# Altium schematic sheet Sematik.SchDoc
size A4; SheetNumber: 2; SheetTotal: 2
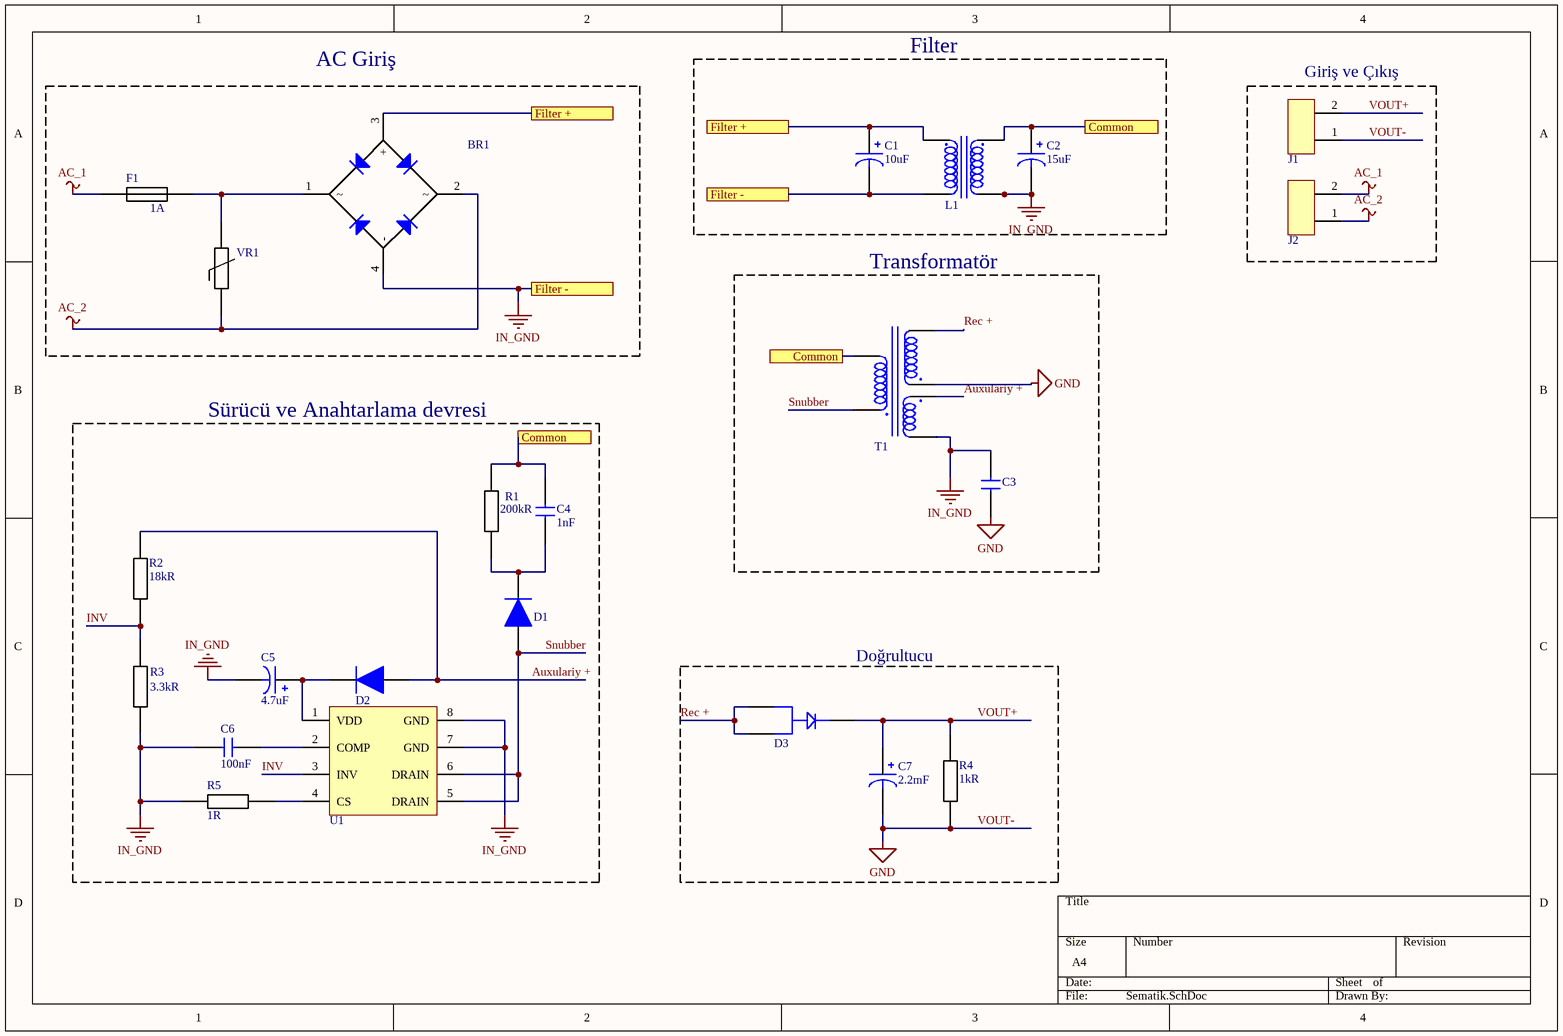
[diagram p0: Sematik.SchDoc]

## Parts
BR1  DB105STR  [DB105STR]  (value not drawn)
C1  value 10uF  [CAP_ALU_10uF]  (hidden comment: UCY2G100MPD1TD)
C2  value 15uF  [CAP_ALU_15uF]  (hidden comment: UCY2G150MPD)
C3  DE2E3SA102MN3AT02F  [CAP_CER_1000pF_250V_RADİAL]  (value not drawn)
C4  value 1nF  [CAP_1206]  (hidden comment: C1206C102KDRACTU)
C5  value 4.7uF  [CAP_ALU_4.7uF]  (hidden comment: 860010672008)
C6  value 100nF  [CAP_0805]  (hidden comment: CL21B104KBCNNNC)
C7  value 2.2mF  [CAP_ALU_2200uF]  (hidden comment: ECA-1AM222)
D1  1N4007G-T  [1N4007G-T Diode]  (value not drawn)
D2  1N4007G-T  [1N4007G-T Diode]  (value not drawn)
D3  SS10P4-M3/86A SCHOTTKY DİODE  [SS10P4-M3/86A]  (value not drawn)
F1  Amper: 1A  [05200101Z Fuse Block]  (hidden comment: 05200101Z)
J1  JACK  [TBP01R1-508]  (value not drawn)
J2  JACK  [TBP01R1-508]  (value not drawn)
L1  LFU09V-102(0.35MM)  [Line Filter Choke Common Mode]  (value not drawn)
R1  value 200kR  [RES-1206]  (hidden comment: RC1206JR-07200KL)
R2  value 18kR  [RES_0805]  (hidden comment: RMCF0805FT18K0)
R3  value 3.3kR  [RES_0805]  (hidden comment: RC0805FR-7W3K3L)
R4  value 1kR  [RES-1206]  (hidden comment: RC1206JR-071KL)
R5  value 1R  [RES-1206]  (hidden comment: RC1206JR-071RL)
T1  750341599  [SMPS TRAFO]  (value not drawn)
U1  UCSR3652SG  [sop-8]  (value not drawn)
VR1  820513011  [820513011 Varistor]  (value not drawn)

## Blocks framed on the sheet
AC Giriş: BR1 F1 VR1
Filter: C1 C2 L1
Giriş ve Çıkış: J1 J2
Transformatör: C3 T1
Sürücü ve Anahtarlama devresi: C4-C6 D1 D2 R1-R3 R5 U1
Doğrultucu: C7 D3 R4

## Ports
Common (see Sematik[2B]), Common (see Sematik[2B], Sematik[3A]), Filter + (see Sematik[2A]), Filter - (see Sematik[2A]), Filter - (see Sematik[2B])

## Nets
AC_1: F1.2 J2.2
AC_2: BR1.2 J2.1 VR1.2
IN_GND: BR1.4(-) C1.2 C2.2 C3.2 C5.2 C6.2 L1.2 L1.3 R3.1 R5.2 T1.4 U1.7(GND) U1.8(GND) ; port Filter -
VOUT-: C3.1 C7.2 J1.1 R4.1 T1.7  [also labelled GND]
Auxulariy +: D2.2 R2.2 T1.5
Common: C2.1 C4.2 L1.4 R1.2 T1.1 ; port Common
Filter +: BR1.3(+) C1.1 L1.1 ; port Filter +
INV: R2.1 R3.2 U1.3(INV)
Rec +: D3.1(ANOT_1) D3.2(ANOT_2) T1.8
Snubber: D1.2 T1.2 U1.5(DRAIN) U1.6(DRAIN)
VOUT+: C7.1 D3.K(KATOT) J1.2 R4.2
NetBR1_1: BR1.1 F1.1 VR1.1
NetC4_1: C4.1 D1.1 R1.1
NetC5_1: C5.1 D2.1 U1.1(VDD)
NetC6_1: C6.1 U1.2(COMP)
NetR5_1: R5.1 U1.4(CS)

## Library data of the parts
BR1 = DB105STR: Bridge Rect 1PHASE 600V 1A Db-s; Manufacturer: Sangdest Microelectronics; Manufacturer Part Number: DB105S; Designed by: Kerem; Supplier: Digikey; Supplier Part Number: 1655-DB105SCT-ND; RoHS: No; Category: Uncategorized; Stock: 8973; Pricing: 1=0,44, 10=0,267, 100=0,1688, 500=0,12602 (USD); ComponentLink1Description: DATASHEET; ComponentLink1URL: https://www.smc-diodes.com/propdf/DB101S%20THRU%20DB107S%20N1459%20REV.B.pdf; Voltage - Peak Reverse (Max): 600V; Current: 1A
C1 = CAP_ALU_10uF: Aluminum Electrolytic Capacitor, Polarized, Aluminum (wet), 400V, 20% +Tol, 20% -Tol, 10uF; Manufacturer: Nichicon; Manufacturer Series: CY; Dielectric Material: Aluminium; Ripple Current: 150mA; Supplier: Mouser; Supplier Part Number: 647-UCY2G100MPD1TD; Manufacturer Part Number: UCY2G100MPD1TD; RoHS: Yes; Category: Aluminum Electrolytic Capacitors; Stock: 11094; Pricing: 1=1,07, 10=0,539, 50=0,539, 100=0,486, 1000=0,351, 10000=0,295 (USD); Pins: 2; Min Operating Temperature: -40°C; Max Operating Temperature: 105°C; Polarity: Polarized; Capacitor Type: Aluminium; Tolerance  (fill in as +-): 20%; Package Style: RadialMeter; Packaging: Tape and Reel; Tolerance (fill in as +-): 20%; Rated DC Voltage (URdc): 400V; Series: CY; Diameter: 10mm; Length: 16mm; Terminal Pitch: 5mm; Reach SVHC Compliant: No; RoHS Compliant: Yes; ComponentLink1URL: https://datasheet.ciiva.com:443/pdfs/VipMasterIC/IC/NICH/NICH-S-A0009255900/NICH-S-A0009255900-1.pdf?src-supplier=IHS+Markit; ComponentLink1Description: https://datasheet.ciiva.com:443/pdfs/VipMasterIC/IC/NICH/NICH-S-A0009255900/NICH-S-A0009255900-1.pdf?src-supplier=IHS+Markit; ComponentLink2URL: https://datasheet.ciiva.com/29547/e-cy-29547366.pdf?src-supplier=Digikey; ComponentLink2Description: https://datasheet.ciiva.com/29547/e-cy-29547366.pdf?src-supplier=Digikey; ComponentLink3URL: https://datasheet.ciiva.com/29547/e-cy-29547367.pdf?src-supplier=Digikey; ComponentLink3Description: https://datasheet.ciiva.com/29547/e-cy-29547367.pdf?src-supplier=Digikey
C2 = CAP_ALU_15uF: Aluminum Electrolytic Capacitor, Polarized, Aluminum (wet), 400V, 20% +Tol, 20% -Tol, 15uF; Manufacturer: Nichicon; Dielectric Material: Aluminium; Ripple Current: 180mA; Supplier: Mouser; Supplier Part Number: 647-UCY2G150MPD; Manufacturer Part Number: UCY2G150MPD; RoHS: Yes; Category: Aluminum Electrolytic Capacitors; Stock: 1314; Pricing: 1=1,25, 10=0,861, 50=0,861, 100=0,632, 1000=0,491, 10000=0,425 (USD); Pins: 2; Terminal Finish: Copper; Min Operating Temperature: -40°C; Max Operating Temperature: 105°C; Polarity: Polarized; Capacitor Type: Aluminium; Tolerance  (fill in as +-): 20%; Package Style: RadialMeter; Packaging: Bulk; Tolerance (fill in as +-): 20%; Rated DC Voltage (URdc): 400V; JESD-609 Code: e3; Diameter: 10mm; Length: 20mm; Terminal Pitch: 5mm; Reach SVHC Compliant: No; RoHS Compliant: Yes; ComponentLink1URL: https://datasheet.ciiva.com:443/pdfs/VipMasterIC/IC/NICH/NICH-S-A0003527728/NICH-S-A0003527728-1.pdf?src-supplier=IHS+Markit; ComponentLink1Description: https://datasheet.ciiva.com:443/pdfs/VipMasterIC/IC/NICH/NICH-S-A0003527728/NICH-S-A0003527728-1.pdf?src-supplier=IHS+Markit; ComponentLink2URL: https://datasheet.ciiva.com/114/e-cy-114566.pdf?src-supplier=Digikey; ComponentLink2Description: https://datasheet.ciiva.com/114/e-cy-114566.pdf?src-supplier=Digikey; ComponentLink3URL: https://datasheet.ciiva.com/11686/e-cy-11686537.pdf?src-supplier=Avnet; ComponentLink3Description: https://datasheet.ciiva.com/11686/e-cy-11686537.pdf?src-supplier=Avnet; ComponentLink4URL: https://datasheet.ciiva.com/5329/e-cy-8386-5329868.pdf?src-supplier=Mouser; ComponentLink4Description: https://datasheet.ciiva.com/5329/e-cy-8386-5329868.pdf?src-supplier=Mouser
C3 = CAP_CER_1000pF_250V_RADİAL: Ceramic Capacitor, Ceramic, 20% +Tol, 20% -Tol, E, -55/+20% TC, 0.001uF, Through Hole Mount; Manufacturer: Murata; Supplier: Mouser; Supplier Part Number: 81-DE2E3SA102MN3AT2F; Manufacturer Part Number: DE2E3SA102MN3AT02F; RoHS: Yes; Category: Ceramic Capacitors; Stock: 12396; Pricing: 1=0,49, 10=0,297, 50=0,297, 100=0,145, 1000=0,11, 10000=0,109 (USD); Pins: 2; Dielectric Material: Ceramic; Capacitor Type: Ceramic; Reach SVHC Compliant: Yes; RoHS Compliant: Yes; ComponentLink1URL: https://psearch.en.murata.com:443/capacitor/product/DE2E3SA102MN3AT02F.pdf?src-supplier=IHS+Markit; ComponentLink1Description: https://psearch.en.murata.com:443/capacitor/product/DE2E3SA102MN3AT02F.pdf?src-supplier=IHS+Markit; ComponentLink2URL: https://search.murata.co.jp/Ceramy/image/img/A01X/G101/ENG/DE2_SA_T0_F_E.pdf?src-supplier=Digikey; ComponentLink2Description: https://search.murata.co.jp/Ceramy/image/img/A01X/G101/ENG/DE2_SA_T0_F_E.pdf?src-supplier=Digikey; ComponentLink3URL: https://datasheet.octopart.com/DE2E3SA102MN3AT02F-Murata-datasheet-166166228.pdf?src-supplier=TME; ComponentLink3Description: https://datasheet.octopart.com/DE2E3SA102MN3AT02F-Murata-datasheet-166166228.pdf?src-supplier=TME
C4 = CAP_CER_1nF_1206: Ceramic Capacitor, Multilayer, Ceramic, 1000V, 10% +Tol, 10% -Tol, X7R, 15% TC, 0.001uF, Surface Mount, 1206; Manufacturer: KEMET; Multilayer: Yes; Rated DC Voltage (URdc): 1kV; Supplier: Mouser; Supplier Part Number: 80-C1206C102KDR; Manufacturer Part Number: C1206C102KDRACTU; RoHS: Yes; Category: Ceramic Capacitors; Stock: 27008; Pricing: 1=0,23, 10=0,114, 50=0,114, 100=0,068, 1000=0,049, 10000=0,036 (USD); Mounting Technology: Surface Mount; Pins: 2; Dielectric Material: Ceramic; Package Shape: Rectangular; Case/Package: 1206; Terminal Finish: Nickel; Min Operating Temperature: -55°C; Max Operating Temperature: 125°C; JESD-609 Code: e3; Capacitor Type: Ceramic; Tolerance  (fill in as +-): 10%; Package Style: SMTMeter; Packaging: Tape and Reel; Tolerance (fill in as +-): 10%; Temperature Characteristics Code: X7R; Termination: Wraparound; Length: 3.2mm; Width: 1.6mm; Height: 1.2mm; Reach SVHC Compliant: Yes; RoHS Compliant: Yes; ComponentLink1URL: https://datasheet.ciiva.com:443/pdfs/VipMasterIC/IC/KEME/KEME-S-A0007630859/KEME-S-A0007630859-1.pdf?src-supplier=IHS+Markit; ComponentLink1Description: https://datasheet.ciiva.com:443/pdfs/VipMasterIC/IC/KEME/KEME-S-A0007630859/KEME-S-A0007630859-1.pdf?src-supplier=IHS+Markit; ComponentLink2URL: https://datasheet.ciiva.com/19476/1567931-19476446.pdf?src-supplier=Jameco; ComponentLink2Description: https://datasheet.ciiva.com/19476/1567931-19476446.pdf?src-supplier=Jameco; ComponentLink3URL: https://datasheet.ciiva.com/22700/1812017-22700535.pdf?src-supplier=Element14; ComponentLink3Description: https://datasheet.ciiva.com/22700/1812017-22700535.pdf?src-supplier=Element14; ComponentLink4URL: https://datasheet.ciiva.com/28610/1918693-28610894.pdf?src-supplier=Element14; ComponentLink4Description: https://datasheet.ciiva.com/28610/1918693-28610894.pdf?src-supplier=Element14
C5 = CAP_ALU_4.7uF: Aluminum Electrolytic Capacitor, Aluminum (wet); Manufacturer: Wurth Electronics; Dielectric Material: Aluminium; Supplier: Mouser; Supplier Part Number: 710-860010672008; Manufacturer Part Number: 860010672008; RoHS: Yes; Category: Aluminum Electrolytic Capacitors; Stock: 5183; Pricing: 1=0,11, 10=0,11, 50=0,096, 100=0,084, 1000=0,056, 10000=0,055 (USD); Pins: 2; Capacitor Type: Aluminium; Reach SVHC Compliant: Yes; RoHS Compliant: Yes; ComponentLink1URL: https://datasheet.ciiva.com:443/pdfs/VipMasterIC/IC/MIDC/MIDC-S-A0000765238/MIDC-S-A0000765796-1.pdf?src-supplier=IHS+Markit; ComponentLink1Description: https://datasheet.ciiva.com:443/pdfs/VipMasterIC/IC/MIDC/MIDC-S-A0000765238/MIDC-S-A0000765796-1.pdf?src-supplier=IHS+Markit; ComponentLink2URL: http://www.farnell.com/datasheets/1879575.pdf?src-supplier=Farnell; ComponentLink2Description: http://www.farnell.com/datasheets/1879575.pdf?src-supplier=Farnell; ComponentLink3URL: http://www.produktinfo.conrad.com/datenblaetter/1200000-1299999/001280181-da-01-en-WCAP_ATG8_ALU_ELEC_CAPS_860010672008.pdf?src-supplier=Conrad; ComponentLink3Description: http://www.produktinfo.conrad.com/datenblaetter/1200000-1299999/001280181-da-01-en-WCAP_ATG8_ALU_ELEC_CAPS_860010672008.pdf?src-supplier=Conrad; ComponentLink4URL: http://katalog.we-online.de/pbs/datasheet/860010672008.pdf?src-supplier=Digikey; ComponentLink4Description: http://katalog.we-online.de/pbs/datasheet/860010672008.pdf?src-supplier=Digikey; ComponentLink5URL: http://www.farnell.com/datasheets/1879575.pdf?src-supplier=Element14; ComponentLink5Description: http://www.farnell.com/datasheets/1879575.pdf?src-supplier=Element14
C6 = CAP_CER_0.1uF_0805: Ceramic Capacitor,50V, %10, 0.1uF, Surface Mount, 0805; Manufacturer: Samsung; Multilayer: Yes; Tolerance  (fill in as +-): 10%; Temperature Characteristics Code: X7R; Designed by: Kerem; Supplier: Digikey; Supplier Part Number: 1276-1003-1-ND; Manufacturer Part Number: CL21B104KBCNNNC; RoHS: Yes; Category: Ceramic Capacitors; Stock: 925106; Pricing: 1=0,1, 10=0,029, 100=0,0175, 1000=0,01156 (USD); Mounting Technology: Surface Mount; Pins: 2; Dielectric Material: Ceramic; Package Shape: Rectangular; Case/Package: 0805; Terminal Finish: Nickel; Min Operating Temperature: -55°C; Max Operating Temperature: 125°C; JESD-609 Code: e3; Capacitor Type: Ceramic; Package Style: SMTMeter; Packaging: Tape and Reel; Tolerance (fill in as +-): 10%; Rated DC Voltage (URdc): 50V; Termination: Wraparound; Length: 2mm; Width: 1.25mm; Height: 0.95mm; Reach SVHC Compliant: Yes; RoHS Compliant: Yes; ComponentLink1URL: https://datasheet.ciiva.com:443/pdfs/VipMasterIC/IC/SEMS/SEMS-S-A0008521003/SEMS-S-A0008521039-1.pdf?src-supplier=IHS+Markit; ComponentLink1Description: https://datasheet.ciiva.com:443/pdfs/VipMasterIC/IC/SEMS/SEMS-S-A0008521003/SEMS-S-A0008521039-1.pdf?src-supplier=IHS+Markit; ComponentLink2URL: https://datasheet.ciiva.com/25710/cl21b104kbcnnnc-25710182.pdf?src-supplier=Digikey; ComponentLink2Description: https://datasheet.ciiva.com/25710/cl21b104kbcnnnc-25710182.pdf?src-supplier=Digikey; ComponentLink3URL: https://datasheet.ciiva.com/29199/454152-da-01-en-vs-kondensator-0805-29199814.pdf?src-supplier=Conrad; ComponentLink3Description: https://datasheet.ciiva.com/29199/454152-da-01-en-vs-kondensator-0805-29199814.pdf?src-supplier=Conrad
C7 = CAP_ALU_2200uF: Aluminum Electrolytic Capacitor, Polarized, Aluminum (wet), 10V, 20% +Tol, 20% -Tol, 2200uF, Through Hole Mount; Manufacturer: Panasonic; Manufacturer Series: M; Dielectric Material: Aluminium; Leakage Current: 220uA; Ripple Current: 920mA; Tan Delta: 0.26; Supplier: Mouser; Supplier Part Number: 667-ECA-1AM222; Manufacturer Part Number: ECA-1AM222; RoHS: Yes; Category: Aluminum Electrolytic Capacitors; Stock: 2404; Pricing: 1=0,63, 10=0,297, 50=0,297, 100=0,23, 1000=0,186, 10000=0,167 (USD); Mounting Technology: Through Hole; Pins: 2; Package Shape: Cylindrical; Terminal Finish: Tin; Min Operating Temperature: -40°C; Max Operating Temperature: 85°C; JESD-609 Code: e3; Polarity: Polarized; Capacitor Type: Aluminium; Tolerance  (fill in as +-): 20%; Package Style: RadialMeter; Packaging: Bulk; Tolerance (fill in as +-): 20%; Rated DC Voltage (URdc): 10V; Series: ECA-M; Termination: Wire; Diameter: 10mm; Length: 20mm; Terminal Pitch: 5mm; Reach SVHC Compliant: Yes; RoHS Compliant: Yes; ComponentLink1URL: https://datasheet.ciiva.com:443/pdfs/VipMasterIC/IC/PANA/PANA-S-A0009459698/PANA-S-A0009459698-1.pdf?src-supplier=IHS+Markit; ComponentLink1Description: https://datasheet.ciiva.com:443/pdfs/VipMasterIC/IC/PANA/PANA-S-A0009459698/PANA-S-A0009459698-1.pdf?src-supplier=IHS+Markit; ComponentLink2URL: https://datasheet.ciiva.com/11780/0900766b80f2e8a9-11780233.pdf?src-supplier=Rs; ComponentLink2Description: https://datasheet.ciiva.com/11780/0900766b80f2e8a9-11780233.pdf?src-supplier=Rs; ComponentLink3URL: https://datasheet.ciiva.com/43458/654936-43458312.pdf?src-supplier=Farnell; ComponentLink3Description: https://datasheet.ciiva.com/43458/654936-43458312.pdf?src-supplier=Farnell; ComponentLink4URL: https://datasheet.ciiva.com/10331/aba0000ce12-10331145.pdf?src-supplier=Avnet; ComponentLink4Description: https://datasheet.ciiva.com/10331/aba0000ce12-10331145.pdf?src-supplier=Avnet; ComponentLink5URL: https://datasheet.ciiva.com/48520/radial-m-eng-tds-48520751.pdf?src-supplier=Distrelec; ComponentLink5Description: https://datasheet.ciiva.com/48520/radial-m-eng-tds-48520751.pdf?src-supplier=Distrelec; ComponentLink6URL: https://datasheet.ciiva.com/30083/49aba0000ce12-30083103.pdf?src-supplier=Onlinecomponents.com; ComponentLink6Description: https://datasheet.ciiva.com/30083/49aba0000ce12-30083103.pdf?src-supplier=Onlinecomponents.com; ComponentLink7URL: https://datasheet.ciiva.com/46387/654936-46387400.pdf?src-supplier=Element14; ComponentLink7Description: https://datasheet.ciiva.com/46387/654936-46387400.pdf?src-supplier=Element14; ComponentLink8URL: https://datasheet.ciiva.com/24027/aba0000ce12-465472-24027112.pdf?src-supplier=Mouser; ComponentLink8Description: https://datasheet.ciiva.com/24027/aba0000ce12-465472-24027112.pdf?src-supplier=Mouser; ComponentLink9URL: https://datasheet.ciiva.com/16395/aba0000ce12-16395615.pdf?src-supplier=Future+Electronics; ComponentLink9Description: https://datasheet.ciiva.com/16395/aba0000ce12-16395615.pdf?src-supplier=Future+Electronics
D1 D2 = 1N4007G-T Diode: Rectifier Diode, 1 Phase, 1 Element, 1A, 1000V V(RRM), Silicon, DO-41; Manufacturer: Diodes; Package Body Material: Plastic; Number of Elements: 1; Rep Pk Reverse Voltage-Max: 1kV; Surface Mount: No; Case Connection: Isolated; Forward Voltage: 1V; Non-rep Pk Forward Current-Max: 30A; Reverse Recovery Time-Max: 2us; Time @ Peak Reflow Temperature-Max (s): 40s; Qualification Status: Not Qualified; Supplier: Mouser; Supplier Part Number: 621-1N4007G-T; Manufacturer Part Number: 1N4007G-T; RoHS: Yes; Category: Rectifier Diodes; Stock: 124927; Pricing: 1=0,16, 10=0,097, 50=0,097, 100=0,08, 1000=0,051, 10000=0,05 (USD); Pins: 2; Diode Element Material: SILICON; Package Shape: Round; Terminal Finish: Tin; Min Operating Temperature: -65°C; Max Operating Temperature: 175°C; JESD-609 Code: e3; Diode Type: RECTIFIER; JESD-30 Code: O-PALF-W2; Max Output current: 1A; Package Style: LONG FORMMeter; Terminal Form: Wire; Terminal Position: AXIAL; Peak Reflow Temperature (Cel): 260°C; RoHS Compliant: Yes; Reach SVHC Compliant: No; JEDEC-95 Code: DO-41; ComponentLink1URL: https://datasheet.ciiva.com:443/pdfs/VipMasterIC/IC/DIOD/DIODS14380/DIODS14380-1.pdf?src-supplier=IHS+Markit; ComponentLink1Description: https://datasheet.ciiva.com:443/pdfs/VipMasterIC/IC/DIOD/DIODS14380/DIODS14380-1.pdf?src-supplier=IHS+Markit; ComponentLink2URL: https://datasheet.ciiva.com/36525/1537942-36525995.pdf?src-supplier=Jameco; ComponentLink2Description: https://datasheet.ciiva.com/36525/1537942-36525995.pdf?src-supplier=Jameco; ComponentLink3URL: https://datasheet.ciiva.com/912/ds29002-912230.pdf?src-supplier=Digikey; ComponentLink3Description: https://datasheet.ciiva.com/912/ds29002-912230.pdf?src-supplier=Digikey; ComponentLink4URL: https://datasheet.ciiva.com/15219/getdatasheetpartid-213960-15219547.pdf?src-supplier=Verical; ComponentLink4Description: https://datasheet.ciiva.com/15219/getdatasheetpartid-213960-15219547.pdf?src-supplier=Verical; ComponentLink5URL: https://datasheet.ciiva.com/16395/ds29002-16395514.pdf?src-supplier=Future+Electronics; ComponentLink5Description: https://datasheet.ciiva.com/16395/ds29002-16395514.pdf?src-supplier=Future+Electronics
D3 = SS10P4-M3/86A: Rectifier Diode, Schottky, 1 Phase, 1 Element, 10A, 40V V(RRM), Silicon, TO-277A; Manufacturer: Vishay Semiconductors; Supplier: Mouser; Supplier Part Number: 625-SS10P4-M3; Manufacturer Part Number: SS10P4-M3/86A; RoHS: No; Category: Rectifier Diodes; Stock: 7172; Pricing: 1=0,93, 10=0,645, 50=0,645, 100=0,521, 1000=0,284, 10000=0,275 (USD); ComponentLink1URL: https://datasheet.ciiva.com:443/pdfs/VipMasterIC/IC/VISH/VISH-S-A0007701170/VISH-S-A0007701170-1.pdf?src-supplier=IHS+Markit; ComponentLink1Description: https://datasheet.ciiva.com:443/pdfs/VipMasterIC/IC/VISH/VISH-S-A0007701170/VISH-S-A0007701170-1.pdf?src-supplier=IHS+Markit; ComponentLink2URL: https://datasheet.ciiva.com/22685/1719836-22685698.pdf?src-supplier=Element14; ComponentLink2Description: https://datasheet.ciiva.com/22685/1719836-22685698.pdf?src-supplier=Element14; ComponentLink3URL: https://datasheet.ciiva.com/4245/ss10p4-4245882.pdf?src-supplier=Arrow+Electronics; ComponentLink3Description: https://datasheet.ciiva.com/4245/ss10p4-4245882.pdf?src-supplier=Arrow+Electronics; ComponentLink4URL: https://datasheet.ciiva.com/911/ss10p4-911286.pdf?src-supplier=Digikey; ComponentLink4Description: https://datasheet.ciiva.com/911/ss10p4-911286.pdf?src-supplier=Digikey; ComponentLink5URL: https://datasheet.ciiva.com/911/ss10p4-911287.pdf?src-supplier=Digikey; ComponentLink5Description: https://datasheet.ciiva.com/911/ss10p4-911287.pdf?src-supplier=Digikey; ComponentLink6URL: https://datasheet.ciiva.com/911/ss10p4-911288.pdf?src-supplier=Digikey; ComponentLink6Description: https://datasheet.ciiva.com/911/ss10p4-911288.pdf?src-supplier=Digikey; ComponentLink7URL: https://datasheet.ciiva.com/16489/ss10p4-16489287.pdf?src-supplier=Future+Electronics; ComponentLink7Description: https://datasheet.ciiva.com/16489/ss10p4-16489287.pdf?src-supplier=Future+Electronics
F1 = 05200101Z Fuse Block: Fuses/Accessories; Manufacturer: Littelfuse; Supplier: Mouser; Supplier Part Number: 576-05200101Z; Manufacturer Part Number: 05200101Z; RoHS: Yes; Category: Fuse Holders; Stock: 10761; Pricing: 1=1,6, 10=1,12, 50=0,908, 100=0,863, 1000=0,718, 10000=0,679 (USD); ComponentLink1URL: https://datasheet.ciiva.com:443/pdfs/VipMasterIC/IC/LFSI/LFSI-S-A0002252627/LFSI-S-A0002252627-1.pdf?src-supplier=IHS+Markit; ComponentLink1Description: https://datasheet.ciiva.com:443/pdfs/VipMasterIC/IC/LFSI/LFSI-S-A0002252627/LFSI-S-A0002252627-1.pdf?src-supplier=IHS+Markit; ComponentLink2URL: https://datasheet.ciiva.com/19458/1712608-19458493.pdf?src-supplier=Jameco; ComponentLink2Description: https://datasheet.ciiva.com/19458/1712608-19458493.pdf?src-supplier=Jameco; ComponentLink3URL: https://datasheet.ciiva.com/295/520-metricomniblock-295549.pdf?src-supplier=Digikey; ComponentLink3Description: https://datasheet.ciiva.com/295/520-metricomniblock-295549.pdf?src-supplier=Digikey; ComponentLink4URL: https://datasheet.ciiva.com/16300/0105-129-clips-16300344.pdf?src-supplier=Future+Electronics; ComponentLink4Description: https://datasheet.ciiva.com/16300/0105-129-clips-16300344.pdf?src-supplier=Future+Electronics; ComponentLink5URL: https://datasheet.ciiva.com/15187/getdatasheetpartid-115097-15187901.pdf?src-supplier=Verical; ComponentLink5Description: https://datasheet.ciiva.com/15187/getdatasheetpartid-115097-15187901.pdf?src-supplier=Verical; ComponentLink6URL: https://datasheet.ciiva.com/4480/520-metricomniblock-4480158.pdf?src-supplier=Mouser; ComponentLink6Description: https://datasheet.ciiva.com/4480/520-metricomniblock-4480158.pdf?src-supplier=Mouser
J1 J2 = TBP01R1-508-02BE: Strip Terminal Block 2 Pins; Manufacturer: CUI Devices; Designed by: Kerem; Supplier: Digikey; Supplier Part Number: 102-6406-ND; Manufacturer Part Number: TBP01R1-508-02BE; RoHS: Yes; Category: Terminal Blocks; Stock: 90039; Pricing: 1=0,47, 10=0,218, 25=0,1684, 50=0,1412, 100=0,121, 400=0,09438, 800=0,08583, 1200=0,08184, 5200=0,0775 (USD); ComponentLink1URL: https://www.cuidevices.com/product/resource/digikeypdf/tbp01r1-508.pdf?src-supplier=Digikey; ComponentLink1Description: https://www.cuidevices.com/product/resource/digikeypdf/tbp01r1-508.pdf?src-supplier=Digikey; ComponentLink2URL: https://datasheet.octopart.com/TBP01R1-508-02BE-CUI-Devices-datasheet-147843976.pdf?src-supplier=Future+Electronics; ComponentLink2Description: https://datasheet.octopart.com/TBP01R1-508-02BE-CUI-Devices-datasheet-147843976.pdf?src-supplier=Future+Electronics; ComponentLink3URL: https://datasheet.octopart.com/TBP01R1-508-02BE-CUI-Devices-datasheet-154730754.pdf?src-supplier=Electro+Sonic; ComponentLink3Description: https://datasheet.octopart.com/TBP01R1-508-02BE-CUI-Devices-datasheet-154730754.pdf?src-supplier=Electro+Sonic
L1 = Line Filter Choke Common Mode
R1 = RES_200K OHM_1206: Fixed Resistor, Metal Glaze/thick Film, 0.25W, 200000ohm, 200V, 5% +/-Tol, 100ppm/Cel, Surface Mount, 1206; Manufacturer: Yageo; Additional Feature: LASER TRIMMABLE; Power: 250mW; Rated Temperature: 70°C; Temperature Coefficient (ppm/Cel): 100; Package Height: 0.55mm; Package Length: 3.1mm; Package Width: 1.6mm; Supplier: Avnet; Supplier Part Number: RC1206JR-07200KL; Manufacturer Part Number: RC1206JR-07200KL; RoHS: Yes; Category: Chip SMD Resistors; Stock: 5000; Pricing: 5000=0,00353, 10000=0,00345, 20000=0,00338, 30000=0,00331, 40000=0,00326 (USD); Mounting Technology: Surface Mount; Pins: 2; Package Shape: Rectangular; Case/Package: 1206; Terminal Finish: Nickel; Min Operating Temperature: -55°C; Max Operating Temperature: 155°C; Tolerance: 5%; JESD-609 Code: e3; Termination: Wraparound; Resistor Type: FIXED RESISTOR; Construction: Chip; Packaging: Tape and Reel; Technology: METAL GLAZE/THICK FILM; Working Voltage: 200V; Reach SVHC Compliant: Yes; RoHS Compliant: Yes; ComponentLink1URL: https://datasheet.ciiva.com:443/pdfs/VipMasterIC/IC/YAGO/YAGO-S-A0008145938/YAGO-S-A0008145938-1.pdf?src-supplier=IHS+Markit; ComponentLink1Description: https://datasheet.ciiva.com:443/pdfs/VipMasterIC/IC/YAGO/YAGO-S-A0008145938/YAGO-S-A0008145938-1.pdf?src-supplier=IHS+Markit; ComponentLink2URL: https://datasheet.ciiva.com/2520/pyu-r-int-thick-7-2520646.pdf?src-supplier=Digikey; ComponentLink2Description: https://datasheet.ciiva.com/2520/pyu-r-int-thick-7-2520646.pdf?src-supplier=Digikey; ComponentLink3URL: https://datasheet.ciiva.com/16746/pyu-rc1206-51-rohs-l-4-16746043.pdf?src-supplier=Future+Electronics; ComponentLink3Description: https://datasheet.ciiva.com/16746/pyu-rc1206-51-rohs-l-4-16746043.pdf?src-supplier=Future+Electronics; ComponentLink4URL: https://datasheet.ciiva.com/2520/pyu-r-int-thick-7-2520645.pdf?src-supplier=Digikey; ComponentLink4Description: https://datasheet.ciiva.com/2520/pyu-r-int-thick-7-2520645.pdf?src-supplier=Digikey
R2 = RES_18K OHM_0805: Fixed Resistor, Metal Glaze/thick Film, 0.125W, 18000ohm, 150V, 1% +/-Tol, 100ppm/Cel, Surface Mount, 0805; Manufacturer: Stackpole Electronics; Power: 125mW; Rated Temperature: 70°C; Temperature Coefficient (ppm/Cel): 100; Package Height: 0.5mm; Package Length: 2mm; Package Width: 1.25mm; Reference Standard: AEC-Q200; Supplier: Avnet; Supplier Part Number: RMCF0805FT18K0; Manufacturer Part Number: RMCF0805FT18K0; RoHS: Yes; Category: Chip SMD Resistors; Stock: 15000; Pricing: 5000=0,00245, 10000=0,00241, 20000=0,00238, 30000=0,00234, 40000=0,0023 (USD); Mounting Technology: Surface Mount; Pins: 2; Package Shape: Rectangular; Case/Package: 0805; Terminal Finish: Nickel; Min Operating Temperature: -55°C; Max Operating Temperature: 155°C; Tolerance: 1%; JESD-609 Code: e3; Resistor Type: FIXED RESISTOR; Construction: Rectangular; Packaging: Tape and Reel; Technology: METAL GLAZE/THICK FILM; Termination: Wraparound; Working Voltage: 150V; Reach SVHC Compliant: Yes; RoHS Compliant: Yes; ComponentLink1URL: https://datasheet.ciiva.com:443/pdfs/VipMasterIC/IC/SEIE/SEIE-S-A0009541969/SEIE-S-A0009541969-1.pdf?src-supplier=IHS+Markit; ComponentLink1Description: https://datasheet.ciiva.com:443/pdfs/VipMasterIC/IC/SEIE/SEIE-S-A0009541969/SEIE-S-A0009541969-1.pdf?src-supplier=IHS+Markit; ComponentLink2URL: http://www.seielect.com/Catalog/SEI-RMCF_RMCP.pdf?src-supplier=Digikey; ComponentLink2Description: http://www.seielect.com/Catalog/SEI-RMCF_RMCP.pdf?src-supplier=Digikey; ComponentLink3URL: https://www.seielect.com/catalog/sei-rmcf_rmcp.pdf?src-supplier=Digikey; ComponentLink3Description: https://www.seielect.com/catalog/sei-rmcf_rmcp.pdf?src-supplier=Digikey; ComponentLink4URL: https://www.seielect.com/catalog/SEI-RMCF_RMCP.pdf?src-supplier=Avnet; ComponentLink4Description: https://www.seielect.com/catalog/SEI-RMCF_RMCP.pdf?src-supplier=Avnet; ComponentLink5URL: https://datasheet.octopart.com/RMCF0805FT18K0-Stackpole-Electronics-datasheet-12534581.pdf?src-supplier=Future+Electronics; ComponentLink5Description: https://datasheet.octopart.com/RMCF0805FT18K0-Stackpole-Electronics-datasheet-12534581.pdf?src-supplier=Future+Electronics; ComponentLink6URL: https://datasheet.octopart.com/RMCF0805FT18K0-Stackpole-Electronics-datasheet-141193804.pdf?src-supplier=Master+Electronics; ComponentLink6Description: https://datasheet.octopart.com/RMCF0805FT18K0-Stackpole-Electronics-datasheet-141193804.pdf?src-supplier=Master+Electronics
R3 = RES_3K3 OHM_0805: 3.3 kOhms ±1% 0.25W, 1/4W Chip Resistor 0805 (2012 Metric) Moisture Resistant Thick Film; Manufacturer: Yageo; Additional Feature: LASER TRIMMABLE; Power: 250mW; Rated Temperature: 70°C; Working Voltage: 150V; Temperature Coefficient (ppm/Cel): 200; Package Height: 0.5mm; Package Length: 2mm; Package Width: 1.25mm; Supplier: Mouser; Supplier Part Number: 603-RC0805FR-7W3K3L; Manufacturer Part Number: RC0805FR-7W3K3L; RoHS: Yes; Category: Chip SMD Resistors; Stock: 4448; Pricing: 1=0,12, 10=0,057, 50=0,057, 100=0,044, 1000=0,031, 10000=0,016 (USD); Mounting Technology: Surface Mount; Pins: 2; Package Shape: Rectangular; Case/Package: 0805; Terminal Finish: Nickel; Min Operating Temperature: -55°C; Max Operating Temperature: 155°C; Tolerance: 1%; JESD-609 Code: e3; Resistor Type: FIXED RESISTOR; Construction: Chip; Packaging: Tape and Reel; Technology: METAL GLAZE/THICK FILM; Termination: Wraparound; Reach SVHC Compliant: Yes; RoHS Compliant: Yes; ComponentLink1URL: https://datasheet.ciiva.com:443/pdfs/VipMasterIC/IC/YAGO/YAGO-S-A0008145938/YAGO-S-A0008145938-1.pdf?src-supplier=IHS+Markit; ComponentLink1Description: https://datasheet.ciiva.com:443/pdfs/VipMasterIC/IC/YAGO/YAGO-S-A0008145938/YAGO-S-A0008145938-1.pdf?src-supplier=IHS+Markit
R4 = RES_1K OHM_1206: Fixed Resistor, Metal Glaze/thick Film, 0.25W, 1000ohm, 200V, 5% +/-Tol, 100ppm/Cel, Surface Mount, 1206; Manufacturer: Yageo; Additional Feature: LASER TRIMMABLE; Power: 250mW; Rated Temperature: 70°C; Temperature Coefficient (ppm/Cel): 100; Package Height: 0.55mm; Package Length: 3.1mm; Package Width: 1.6mm; Supplier: Future Electronics; Supplier Part Number: 4749537; Manufacturer Part Number: RC1206JR-071KL; RoHS: Yes; Category: Chip SMD Resistors; Stock: 780000; Pricing: 5000=0,0029, 25000=0,0028, 100000=0,0027, 250000=0,0026, 625000=0,0025 (USD); Mounting Technology: Surface Mount; Pins: 2; Package Shape: Rectangular; Case/Package: 1206; Terminal Finish: Nickel; Min Operating Temperature: -55°C; Max Operating Temperature: 155°C; Tolerance: 5%; JESD-609 Code: e3; Resistor Type: FIXED RESISTOR; Construction: Chip; Packaging: Tape and Reel; Technology: METAL GLAZE/THICK FILM; Termination: Wraparound; Working Voltage: 200V; Reach SVHC Compliant: Yes; RoHS Compliant: Yes; ComponentLink1URL: https://datasheet.ciiva.com:443/pdfs/VipMasterIC/IC/YAGO/YAGO-S-A0008145938/YAGO-S-A0008145938-1.pdf?src-supplier=IHS+Markit; ComponentLink1Description: https://datasheet.ciiva.com:443/pdfs/VipMasterIC/IC/YAGO/YAGO-S-A0008145938/YAGO-S-A0008145938-1.pdf?src-supplier=IHS+Markit; ComponentLink2URL: https://datasheet.ciiva.com/2458/pyu-r-int-thick-7-2458671.pdf?src-supplier=Digikey; ComponentLink2Description: https://datasheet.ciiva.com/2458/pyu-r-int-thick-7-2458671.pdf?src-supplier=Digikey
R5 = RES_1 OHM_1206: Fixed Resistor, Metal Glaze/thick Film, 0.25W, 1ohm, 200V, 5% +/-Tol, 200ppm/Cel, Surface Mount, 1206; Manufacturer: Yageo; Additional Feature: LASER TRIMMABLE; Power: 250mW; Rated Temperature: 70°C; Temperature Coefficient (ppm/Cel): 200; Package Height: 0.55mm; Package Length: 3.1mm; Package Width: 1.6mm; Supplier: Future Electronics; Supplier Part Number: 5918024; Manufacturer Part Number: RC1206JR-071RL; RoHS: Yes; Category: Chip SMD Resistors; Stock: 85000; Pricing: 5000=0,0043, 20000=0,0041, 75000=0,0039, 200000=0,0038, 500000=0,0036 (USD); Mounting Technology: Surface Mount; Pins: 2; Package Shape: Rectangular; Case/Package: 1206; Terminal Finish: Nickel; Min Operating Temperature: -55°C; Max Operating Temperature: 155°C; Tolerance: 5%; JESD-609 Code: e3; Termination: Wraparound; Resistor Type: FIXED RESISTOR; Construction: Chip; Packaging: Tape and Reel; Technology: METAL GLAZE/THICK FILM; Working Voltage: 200V; Reach SVHC Compliant: Yes; RoHS Compliant: Yes; ComponentLink1URL: https://datasheet.ciiva.com:443/pdfs/VipMasterIC/IC/YAGO/YAGO-S-A0008145938/YAGO-S-A0008145938-1.pdf?src-supplier=IHS+Markit; ComponentLink1Description: https://datasheet.ciiva.com:443/pdfs/VipMasterIC/IC/YAGO/YAGO-S-A0008145938/YAGO-S-A0008145938-1.pdf?src-supplier=IHS+Markit; ComponentLink2URL: https://datasheet.ciiva.com/2458/pyu-r-int-thick-7-2458887.pdf?src-supplier=Digikey; ComponentLink2Description: https://datasheet.ciiva.com/2458/pyu-r-int-thick-7-2458887.pdf?src-supplier=Digikey; ComponentLink3URL: https://datasheet.ciiva.com/2458/pyu-r-int-thick-7-2458888.pdf?src-supplier=Digikey; ComponentLink3Description: https://datasheet.ciiva.com/2458/pyu-r-int-thick-7-2458888.pdf?src-supplier=Digikey; ComponentLink4URL: https://datasheet.ciiva.com/2458/pyu-r-int-thick-7-2458889.pdf?src-supplier=Digikey; ComponentLink4Description: https://datasheet.ciiva.com/2458/pyu-r-int-thick-7-2458889.pdf?src-supplier=Digikey; ComponentLink5URL: https://datasheet.ciiva.com/17017/pyu-rc1206-51-rohs-l-4-17017071.pdf?src-supplier=Future+Electronics; ComponentLink5Description: https://datasheet.ciiva.com/17017/pyu-rc1206-51-rohs-l-4-17017071.pdf?src-supplier=Future+Electronics
T1 = EE-22 SMPS_TRAFO: SMPS Transformer; Manufacturer: Wurth Electronics Midcom; Supplier: Mouser; Supplier Part Number: 710-750341599; Manufacturer Part Number: 750341599; RoHS: Yes; Category: Transformers; Pricing: 1=4,99, 10=4,92, 50=4,74, 100=4,02, 1000=3,52, 10000=2,82 (USD); Transformer Type: SMPS TRANSFORMER; Reach SVHC Compliant: Yes; RoHS Compliant: No; ComponentLink1URL: https://datasheet.ciiva.com:443/pdfs/VipMasterIC/IC/MIDC/MIDC-S-A0004708843/MIDC-S-A0004709866-1.pdf?src-supplier=IHS+Markit; ComponentLink1Description: https://datasheet.ciiva.com:443/pdfs/VipMasterIC/IC/MIDC/MIDC-S-A0004708843/MIDC-S-A0004709866-1.pdf?src-supplier=IHS+Markit; ComponentLink2URL: https://datasheet.ciiva.com/18573/750341599-dwg-18573719.pdf?src-supplier=Digikey; ComponentLink2Description: https://datasheet.ciiva.com/18573/750341599-dwg-18573719.pdf?src-supplier=Digikey
VR1 = 820513011 Varistor: Varistor, 385V, 70J, Through Hole Mount; Manufacturer: Wurth Electronics; Circuit RMS Voltage-Max: 300V; Power: 400mW; Supplier: Mouser; Supplier Part Number: 710-820513011; Manufacturer Part Number: 820513011; RoHS: Yes; Category: Varistors; Stock: 21997; Pricing: 1=0,72, 10=0,493, 50=0,405, 100=0,405, 1000=0,393, 10000=0,393 (USD); Mounting Technology: Through Hole; Pins: 2; Package Shape: Disk; Min Operating Temperature: -40°C; Max Operating Temperature: 125°C; Resistor Type: VARISTOR; Circuit DC Voltage-Max: 385V; Energy Absorbing Capacity-Max: 70J; Terminal Placement: Radial; Termination: Wire; Reach SVHC Compliant: Yes; RoHS Compliant: Yes; ComponentLink1URL: https://datasheet.ciiva.com:443/pdfs/VipMasterIC/IC/MIDC/MIDC-S-A0007237670/MIDC-S-A0007085238-1.pdf?src-supplier=IHS+Markit; ComponentLink1Description: https://datasheet.ciiva.com:443/pdfs/VipMasterIC/IC/MIDC/MIDC-S-A0007237670/MIDC-S-A0007085238-1.pdf?src-supplier=IHS+Markit; ComponentLink2URL: http://www.farnell.com/datasheets/2372859.pdf?src-supplier=Farnell; ComponentLink2Description: http://www.farnell.com/datasheets/2372859.pdf?src-supplier=Farnell; ComponentLink3URL: https://katalog.we-online.de/pbs/datasheet/820513011.pdf?src-supplier=Digikey; ComponentLink3Description: https://katalog.we-online.de/pbs/datasheet/820513011.pdf?src-supplier=Digikey